# EAGLE schematic RJ45_Adapter_v18 (EAGLE 9.7.0)
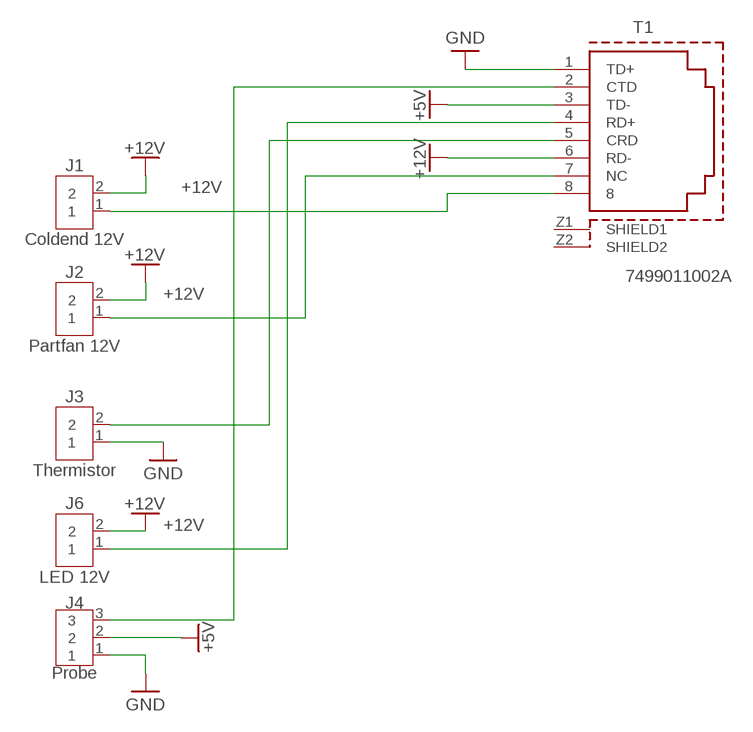
[diagram p0: schematic, sheet 1]

## Parts
J1  Coldend 12V  B2B-XH-A  [B2B-XH-A]
J2  Partfan 12V  B2B-XH-A  [B2B-XH-A]
J3  Thermistor  B2B-XH-A  [B2B-XH-A]
J4  Probe  B3B-XH-A  [B3B-XH-A]
J6  LED 12V  B2B-XH-A  [B2B-XH-A]
T1  7499011002A  WE-RJ45_7499011002A  [7499011002A]

## Nets
+5V: J4.2 T1.3(TD-)
+12V: J1.2 J2.2 J6.2 T1.6(RD-)
GND: J3.1 J4.1 T1.1(TD+)
N$1: J4.3 T1.2(CTD)
N$2: J3.2 T1.5(CRD)
N$3: J6.1 T1.4(RD+)
N$4: J2.1 T1.7(NC)
N$5: J1.1 T1.8
Unconnected: T1.Z1(SHIELD1) T1.Z2(SHIELD2)

## Library data of the parts
J1-J3 J6 = ConnectorVelo17:B2B-XH-A: XH Connector Top Entry - 2POS Details see: Datasheet <http://www.jst-mfg.com/product/pdf/eng/eXH.pdf>; CATEGORY: CONNECTOR; DESCRIPTION: 2.5mm pitch/disconnectable crimp style connector; MANUFACTURER: JST (XH CONNECTOR); MPN: B2B-XH-A; OPERATING_TEMPERATURE: -25°C ~ 85°C; PART_STATUS: ACTIVE; ROHS_COMPLIANT: COMPLIANT; SERIES: B_B-XH-A; SUB_CATEGORY: Through hole connector; TYPE: top entry; VALUE: 3A/250V
J4 = XH3:B3B-XH-A: XH Connector Top Entry - 3POS Details see: Datasheet <http://www.jst-mfg.com/product/pdf/eng/eXH.pdf>; CATEGORY: CONNECTOR; DESCRIPTION: 2.5mm pitch/disconnectable crimp style connector; MANUFACTURER: JST (XH connector); MPN: B3B-XH-A; PART_STATUS: ACTIVE; ROHS_COMPLIANT: COMPLIANT; SERIES: B3B-XH-A; SUB_CATEGORY: THROUGH HOLE CONNECTOR; TYPE: SIDE ENTRY; VALUE: 3A/250V
T1 = Wurth_Signal & Communications_WE-RJ45_LAN:WE-RJ45_7499011002A: WE-RJ45 LAN Transformer Characteristics RJ45 Connector with integrated transformer / common mode choke Power over Ethernet up to 50 Watt and speeds up to 10 Gbit/s Available in SMD, THT and THT with USB Compliant with standards: IEEE 802.3u, IEEE 802.3ab, IEEE 802.3af, IEEE 802.3at, IEEE 802.3an and upcoming IEE 802.3bt Applications Suitable for industrial temperatures from –40 °C up to +85 °C Compatible to Industrial Ethernet systems like EtherCAT or Profinet Compliant with most IC’s for Ethernet applications such as Microchip, Texas Instruments, Broadcom, Linear Technology Hubs, Routers, Switches, IP cameras, IoT applications <https://www.we-online.com/catalog/media/o35731v209%20Family_WE-RJ45-LAN.jpg> Details see: https://www.we-online.com/catalog/en/WE-LAN-RJ45 Updated by Ella Wu 2019-08-05 2019 (C) Wurth Elektronik; DATA-RATE: 10/100 Base-T; DATASHEET-URL: https://www.we-online.com/catalog/datasheet/7499011002A.pdf; LED: -; MOUNT: THT; PART-NUMBER: 7499011002A; POE: non-PoE; PORTS: 1; USB: No

## Net classes
0 default: width 0.508 mm, clearance 0.254 mm